# Altium schematic sheet 2225B_VumetreFrequenciel.SchDoc: 2225B_VumetreFrequentiel
size 408 x 276 mm; Date: 24.09.2024; DrawnBy: LDA; DocumentNumber: 1.0; SheetNumber: 1; SheetTotal: 6
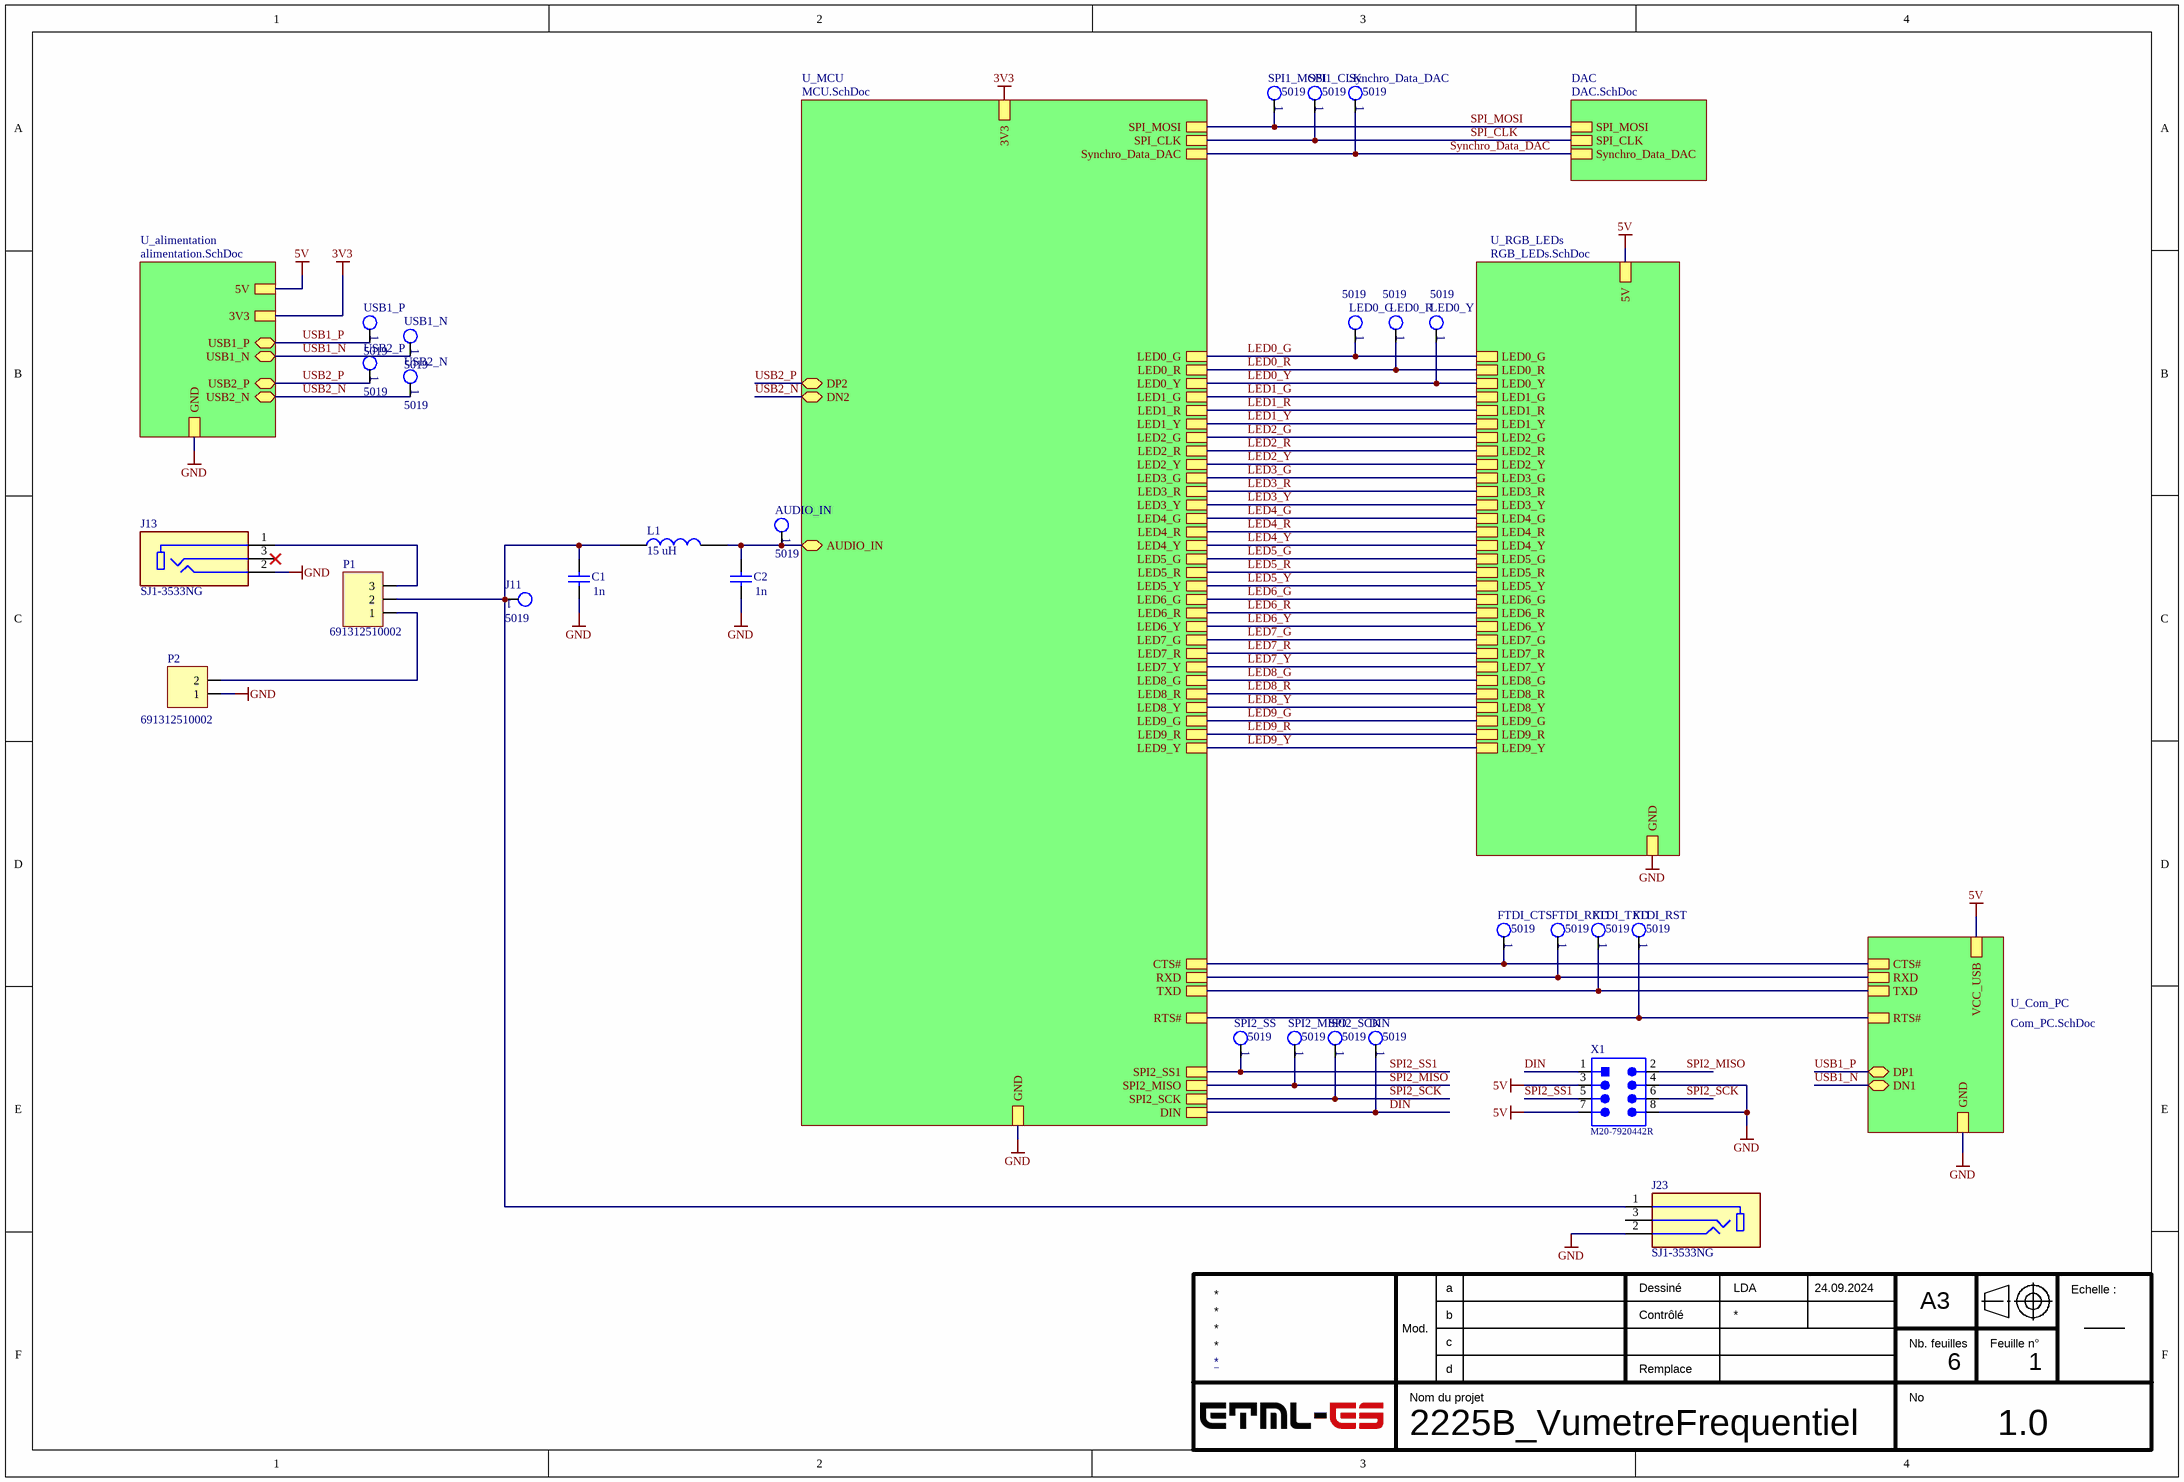
[diagram p0: 2225B_VumetreFrequenciel.SchDoc]

## Parts
AUDIO_IN  5019  [KEYSTONE_5019]
C1  1n  [C0805]
C2  1n  [C0805]
DIN  5019  [KEYSTONE_5019]
FTDI_CTS  5019  [KEYSTONE_5019]
FTDI_RST  5019  [KEYSTONE_5019]
FTDI_RXD  5019  [KEYSTONE_5019]
FTDI_TXD  5019  [KEYSTONE_5019]
J11  5019  [KEYSTONE_5019]
J13  SJ1-3533NG  [CUI_SJ1-3533NG]
J23  SJ1-3533NG  [CUI_SJ1-3533NG]
L1  15 uH  [WE-PD_1210]
LED0_G  5019  [KEYSTONE_5019]
LED0_R  5019  [KEYSTONE_5019]
LED0_Y  5019  [KEYSTONE_5019]
P1  691312510002  [61300311121]
P2  691312510002  [LINX_CONBNC002]
SPI1_CLK  5019  [KEYSTONE_5019]
SPI1_MOSI  5019  [KEYSTONE_5019]
SPI2_MISO  5019  [KEYSTONE_5019]
SPI2_SCK  5019  [KEYSTONE_5019]
SPI2_SS  5019  [KEYSTONE_5019]
Synchro_Data_DAC  5019  [KEYSTONE_5019]
USB1_N  5019  [KEYSTONE_5019]
USB1_P  5019  [KEYSTONE_5019]
USB2_N  5019  [KEYSTONE_5019]
USB2_P  5019  [KEYSTONE_5019]
X1  M20-7920442R  [610108249121]

## Sub-sheets
DAC = DAC.SchDoc: SPI_MOSI, SPI_CLK, Synchro_Data_DAC
U_alimentation = alimentation.SchDoc: 5V, 3V3, GND, USB1_P (bidir), USB2_P (bidir), USB1_N (bidir), USB2_N (bidir)
U_Com_PC = Com_PC.SchDoc: CTS#, RXD, TXD, GND, RTS#, VCC_USB, DP1 (bidir), DN1 (bidir)
U_MCU = MCU.SchDoc: AUDIO_IN (bidir), 3V3, GND, Synchro_Data_DAC, SPI_CLK, SPI_MOSI, CTS#, RXD, TXD, RTS#, DP2 (bidir), DN2 (bidir), DIN, SPI2_SCK, SPI2_MISO, SPI2_SS1, LED0_G, LED0_R, LED0_Y, LED1_G, LED1_R, LED2_G, LED1_Y, LED2_R, LED2_Y, LED3_G, LED3_R, LED3_Y, LED4_G, LED4_R, LED4_Y, LED5_G, LED5_R, LED5_Y, LED6_G, LED6_R, LED6_Y, LED7_G, LED7_R, LED7_Y, LED8_G, LED8_R, LED8_Y, LED9_G, LED9_R, LED9_Y
U_RGB_LEDs = RGB_LEDs.SchDoc: 5V, GND, LED0_G, LED0_R, LED0_Y, LED1_G, LED1_R, LED1_Y, LED2_G, LED2_R, LED2_Y, LED3_G, LED3_R, LED3_Y, LED4_G, LED4_R, LED4_Y, LED5_G, LED5_R, LED5_Y, LED6_G, LED6_R, LED6_Y, LED7_G, LED7_R, LED7_Y, LED8_G, LED8_R, LED8_Y, LED9_G, LED9_R, LED9_Y

## Nets
3V3: sheet U_alimentation/3V3, sheet U_MCU/3V3
5V: X1.3 X1.7 ; sheet U_alimentation/5V, sheet U_Com_PC/VCC_USB, sheet U_RGB_LEDs/5V
GND: C1.2 C2.2 J13.2 J23.2 P2.1 X1.4 X1.8 ; sheet U_alimentation/GND, sheet U_Com_PC/GND, sheet U_MCU/GND, sheet U_RGB_LEDs/GND
DIN: DIN.1 X1.1 ; sheet U_MCU/DIN
LED0_G: LED0_G.1 ; sheet U_MCU/LED0_G, sheet U_RGB_LEDs/LED0_G
LED0_R: LED0_R.1 ; sheet U_MCU/LED0_R, sheet U_RGB_LEDs/LED0_R
LED0_Y: LED0_Y.1 ; sheet U_MCU/LED0_Y, sheet U_RGB_LEDs/LED0_Y
LED1_G: sheet U_MCU/LED1_G, sheet U_RGB_LEDs/LED1_G
LED1_R: sheet U_MCU/LED1_R, sheet U_RGB_LEDs/LED1_R
LED1_Y: sheet U_MCU/LED1_Y, sheet U_RGB_LEDs/LED1_Y
LED2_G: sheet U_MCU/LED2_G, sheet U_RGB_LEDs/LED2_G
LED2_R: sheet U_MCU/LED2_R, sheet U_RGB_LEDs/LED2_R
LED2_Y: sheet U_MCU/LED2_Y, sheet U_RGB_LEDs/LED2_Y
LED3_G: sheet U_MCU/LED3_G, sheet U_RGB_LEDs/LED3_G
LED3_R: sheet U_MCU/LED3_R, sheet U_RGB_LEDs/LED3_R
LED3_Y: sheet U_MCU/LED3_Y, sheet U_RGB_LEDs/LED3_Y
LED4_G: sheet U_MCU/LED4_G, sheet U_RGB_LEDs/LED4_G
LED4_R: sheet U_MCU/LED4_R, sheet U_RGB_LEDs/LED4_R
LED4_Y: sheet U_MCU/LED4_Y, sheet U_RGB_LEDs/LED4_Y
LED5_G: sheet U_MCU/LED5_G, sheet U_RGB_LEDs/LED5_G
LED5_R: sheet U_MCU/LED5_R, sheet U_RGB_LEDs/LED5_R
LED5_Y: sheet U_MCU/LED5_Y, sheet U_RGB_LEDs/LED5_Y
LED6_G: sheet U_MCU/LED6_G, sheet U_RGB_LEDs/LED6_G
LED6_R: sheet U_MCU/LED6_R, sheet U_RGB_LEDs/LED6_R
LED6_Y: sheet U_MCU/LED6_Y, sheet U_RGB_LEDs/LED6_Y
LED7_G: sheet U_MCU/LED7_G, sheet U_RGB_LEDs/LED7_G
LED7_R: sheet U_MCU/LED7_R, sheet U_RGB_LEDs/LED7_R
LED7_Y: sheet U_MCU/LED7_Y, sheet U_RGB_LEDs/LED7_Y
LED8_G: sheet U_MCU/LED8_G, sheet U_RGB_LEDs/LED8_G
LED8_R: sheet U_MCU/LED8_R, sheet U_RGB_LEDs/LED8_R
LED8_Y: sheet U_MCU/LED8_Y, sheet U_RGB_LEDs/LED8_Y
LED9_G: sheet U_MCU/LED9_G, sheet U_RGB_LEDs/LED9_G
LED9_R: sheet U_MCU/LED9_R, sheet U_RGB_LEDs/LED9_R
LED9_Y: sheet U_MCU/LED9_Y, sheet U_RGB_LEDs/LED9_Y
SPI2_MISO: SPI2_MISO.1 X1.2 ; sheet U_MCU/SPI2_MISO
SPI2_SCK: SPI2_SCK.1 X1.6 ; sheet U_MCU/SPI2_SCK
SPI2_SS1: SPI2_SS.1 X1.5 ; sheet U_MCU/SPI2_SS1
SPI_CLK: SPI1_CLK.1 ; sheet U_MCU/SPI_CLK, sheet DAC/SPI_CLK
SPI_MOSI: SPI1_MOSI.1 ; sheet U_MCU/SPI_MOSI, sheet DAC/SPI_MOSI
Synchro_Data_DAC: Synchro_Data_DAC.1 ; sheet U_MCU/Synchro_Data_DAC, sheet DAC/Synchro_Data_DAC
USB1_N: USB1_N.1 ; sheet U_alimentation/USB1_N, sheet U_Com_PC/DN1
USB1_P: USB1_P.1 ; sheet U_alimentation/USB1_P, sheet U_Com_PC/DP1
USB2_N: USB2_N.1 ; sheet U_alimentation/USB2_N, sheet U_MCU/DN2
USB2_P: USB2_P.1 ; sheet U_alimentation/USB2_P, sheet U_MCU/DP2
NetAUDIO_IN_1: AUDIO_IN.1 C2.1 L1.2 ; sheet U_MCU/AUDIO_IN
NetC1_1: C1.1 J11.1 J23.1 L1.1 P1.2
NetFTDI_CTS_1: FTDI_CTS.1 ; sheet U_Com_PC/CTS#, sheet U_MCU/CTS#
NetFTDI_RST_1: FTDI_RST.1 ; sheet U_Com_PC/RTS#, sheet U_MCU/RTS#
NetFTDI_RXD_1: FTDI_RXD.1 ; sheet U_Com_PC/RXD, sheet U_MCU/RXD
NetFTDI_TXD_1: FTDI_TXD.1 ; sheet U_Com_PC/TXD, sheet U_MCU/TXD
NetJ13_1: J13.1 P1.3
NetP1_1: P1.1 P2.2

Not connected (* = marked no-connect by the designer): J13 3*; J23 3

## Notes on the sheet
- a
- Dessiné
- A3
- Echelle :
- Mod.
- b
- c
- d
- Contrôlé
- Remplace
- Nb. feuilles
- Feuille n°
- Nom du projet
- No

## Library data of the parts
AUDIO_IN DIN FTDI_CTS FTDI_RST FTDI_RXD FTDI_TXD J11 SPI1_CLK SPI1_MOSI SPI2_MISO SPI2_SCK SPI2_SS Synchro_Data_DAC USB1_N USB1_P USB2_N USB2_P = CMP-1672-00008-2: NexarPartId: 22052288; Manufacturer: Keystone Electronics; Number of Contacts: 1; Contact Material: Bronze, Silver; Number of Pins: 1; Lead Free: Lead Free; Packaging: Tape and Reel; Mount: Surface Mount; Height: 2.286mm; Contact Plating: Silver; Material: Bronze; Termination: SMD/SMT; REACH SVHC: No SVHC; RoHS: Compliant; Manufacturer Part Number: 5019
C1 C2 = Cap: Capacitor; Published: 8-Jun-2000; LatestRevisionDate: 17-Jul-2002; LatestRevisionNote: Re-released for DXP Platform.; PackageReference: RAD-0.3; Publisher: Altium Limited; PackageDescription: Radial Cap, Thru-Hole; 2 Leads; 0.3 in Pin Spacing; Value: 1n
J13 J23 = SJ1-3533NG: 3.5 mm Right-Angle Stereo Jack, 3 Pin PCB Mount, Isolated Ground; MF: {'manufacturer': u'CUI'}; Price: None; Availability: Unavailable; Package: None; MP: SJ1-3533NG; Value: *
L1 = CDRH125NP-220MC: Fixed Inductors 22uH 2.80A 0.028ohms; Manufacturer_Name: Sumida; Geometry.Height: 6mm; Future Part Number: *; Future Price/Stock: *; Manufacturer_Part_Number: CDRH125NP-220MC; Datasheet Link: http://products.sumida.com/products/pdf/CDRH125,CDRH125LD.pdf
LED0_G LED0_R LED0_Y = CMP-1672-00008-2: NexarPartId: 22052288; Manufacturer: Keystone Electronics; Number of Contacts: 1; Material: Bronze; Contact Material: Bronze, Silver; Number of Pins: 1; Lead Free: Lead Free; Packaging: Tape and Reel; Mount: Surface Mount; Height: 2.286mm; Contact Plating: Silver; Termination: SMD/SMT; REACH SVHC: No SVHC; RoHS: Compliant; Manufacturer Part Number: 5019
P1 = MHDR1X3: Header, 3-Pin; LatestRevisionDate: 17-Jul-2002; LatestRevisionNote: Re-released for DXP Platform.; Publisher: Altium Limited
P2 = MHDR1X2: Header, 2-Pin; LatestRevisionDate: 17-Jul-2002; LatestRevisionNote: Re-released for DXP Platform.; Publisher: Altium Limited
X1 = 610108249121: WR-PHD Pin Header, THT, pitch 2.54mm, Dual Row, Angled, 8p; Manufacturer Part Number: 61300821021; Manufacturer: Wurth Elektronik; Pin Number: 8; Rated Current: 3A; Working Voltage: 250VAC; Withstanding Voltage: 500VAC; Contact Resistance: 20mOhm; ComponentLink1Description: Manufacturer; ComponentLink1URL: http://www.we-online.de; ComponentLink2Description: Datasheet; ComponentLink2URL: https://www.we-online.com/catalog/datasheet/61300821021.pdf; Pitch: 2.54mm; Operating Temperature: -40 to +105degC; Mounting Technology: THT; Packaging: Bag; Gender: Pin Header; Row Number: Dual; Orientation: Angled